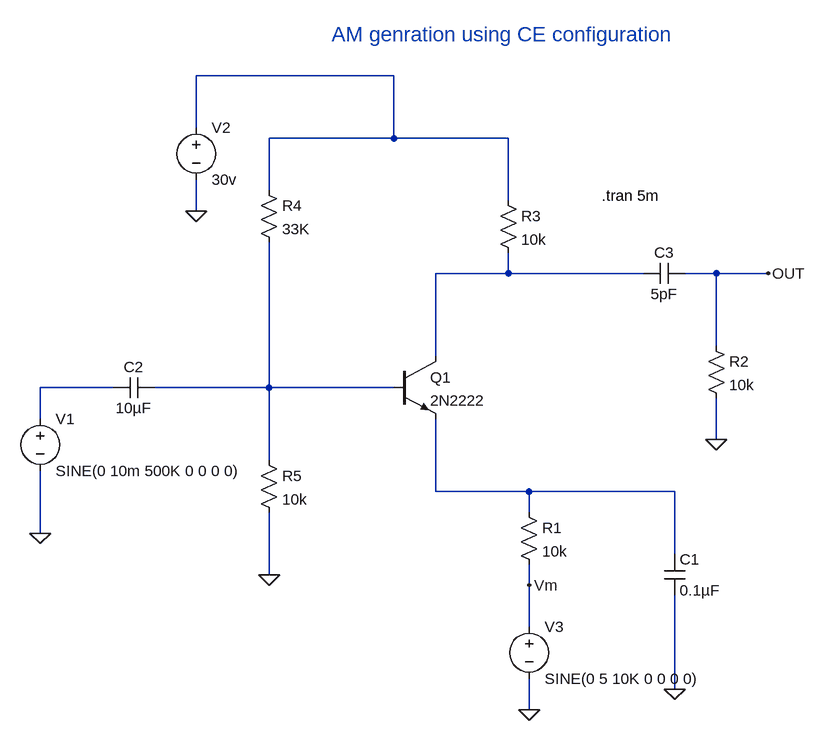
[diagram p0: schematic AM_modulator_CE_configuration.asc]
AM_modulator_CE_configuration.asc, the LTspice schematic file:
Version 4
SHEET 1 1100 692
WIRE 192 -304 -112 -304
WIRE -112 -224 -112 -304
WIRE 192 -208 192 -304
WIRE 192 -208 0 -208
WIRE 368 -208 192 -208
WIRE 0 -128 0 -208
WIRE 368 -112 368 -208
WIRE -112 -96 -112 -144
WIRE 368 0 368 -32
WIRE 368 0 256 0
WIRE 576 0 368 0
WIRE 688 0 640 0
WIRE 768 0 688 0
WIRE 688 112 688 0
WIRE 256 128 256 0
WIRE -240 176 -352 176
WIRE 0 176 0 -48
WIRE 0 176 -176 176
WIRE 192 176 0 176
WIRE -352 224 -352 176
WIRE 688 256 688 192
WIRE 0 288 0 176
WIRE 256 336 256 224
WIRE 400 336 256 336
WIRE 624 336 400 336
WIRE 400 368 400 336
WIRE -352 400 -352 304
WIRE 624 432 624 336
WIRE 0 464 0 368
WIRE 400 480 400 448
WIRE 400 544 400 480
WIRE 624 640 624 496
WIRE 400 672 400 624
FLAG 624 640 0
FLAG 688 256 0
FLAG 0 464 0
FLAG -112 -96 0
FLAG 768 0 OUT
FLAG 400 480 Vm
FLAG -352 400 0
FLAG 400 672 0
SYMBOL npn 192 128 R0
SYMATTR InstName Q1
SYMATTR Value 2N2222
SYMBOL res 384 352 R0
SYMATTR InstName R1
SYMATTR Value 10k
SYMBOL res 672 96 R0
SYMATTR InstName R2
SYMATTR Value 10k
SYMBOL res 352 -128 R0
SYMATTR InstName R3
SYMATTR Value 10k
SYMBOL res -16 -144 R0
SYMATTR InstName R4
SYMATTR Value 33K
SYMBOL res -16 272 R0
SYMATTR InstName R5
SYMATTR Value 10k
SYMBOL voltage -112 -240 R0
WINDOW 123 0 0 Left 0
WINDOW 39 0 0 Left 0
SYMATTR InstName V2
SYMATTR Value 30v
SYMBOL cap 608 432 R0
SYMATTR InstName C1
SYMATTR Value 0.1µF
SYMBOL cap -176 160 R90
WINDOW 0 0 32 VBottom 2
WINDOW 3 32 32 VTop 2
SYMATTR InstName C2
SYMATTR Value 10µF
SYMBOL cap 640 -16 R90
WINDOW 0 0 32 VBottom 2
WINDOW 3 32 32 VTop 2
SYMATTR InstName C3
SYMATTR Value 5pF
SYMBOL voltage -352 208 R0
WINDOW 123 0 0 Left 0
WINDOW 39 0 0 Left 0
SYMATTR InstName V1
SYMATTR Value SINE(0 10m 500K 0 0 0 0)
SYMBOL voltage 400 528 R0
WINDOW 123 0 0 Left 0
WINDOW 39 0 0 Left 0
SYMATTR InstName V3
SYMATTR Value SINE(0 5 10K 0 0 0 0)
TEXT 512 -120 Left 2 !.tran 5m
TEXT 96 -368 Left 3 ;AM genration using CE configuration

The netlist it stands for:
* AM_modulator_CE_configuration.asc
Q1 N002 N004 N005 0 2N2222
R1 N005 Vm 10k
R2 OUT 0 10k
R3 N001 N002 10k
R4 N001 N004 33K
R5 N004 0 10k
V2 N001 0 30v
C1 N005 0 0.1µF
C2 N004 N003 10µF
C3 OUT N002 5pF
V1 N003 0 SINE(0 10m 500K 0 0 0 0)
V3 Vm 0 SINE(0 5 10K 0 0 0 0)
.model NPN NPN
.model PNP PNP
.lib standard.bjt
.tran 5m
* AM genration using CE configuration
.backanno
.end